# EasyEDA schematic lighting_schematic.json
TITLE: PeaPod Lighting; REV: 0.1; Date: 2021-03-17; Sheet: 1/1; Drawn By: Jayden Lefebvre; Company: UofT Agritech
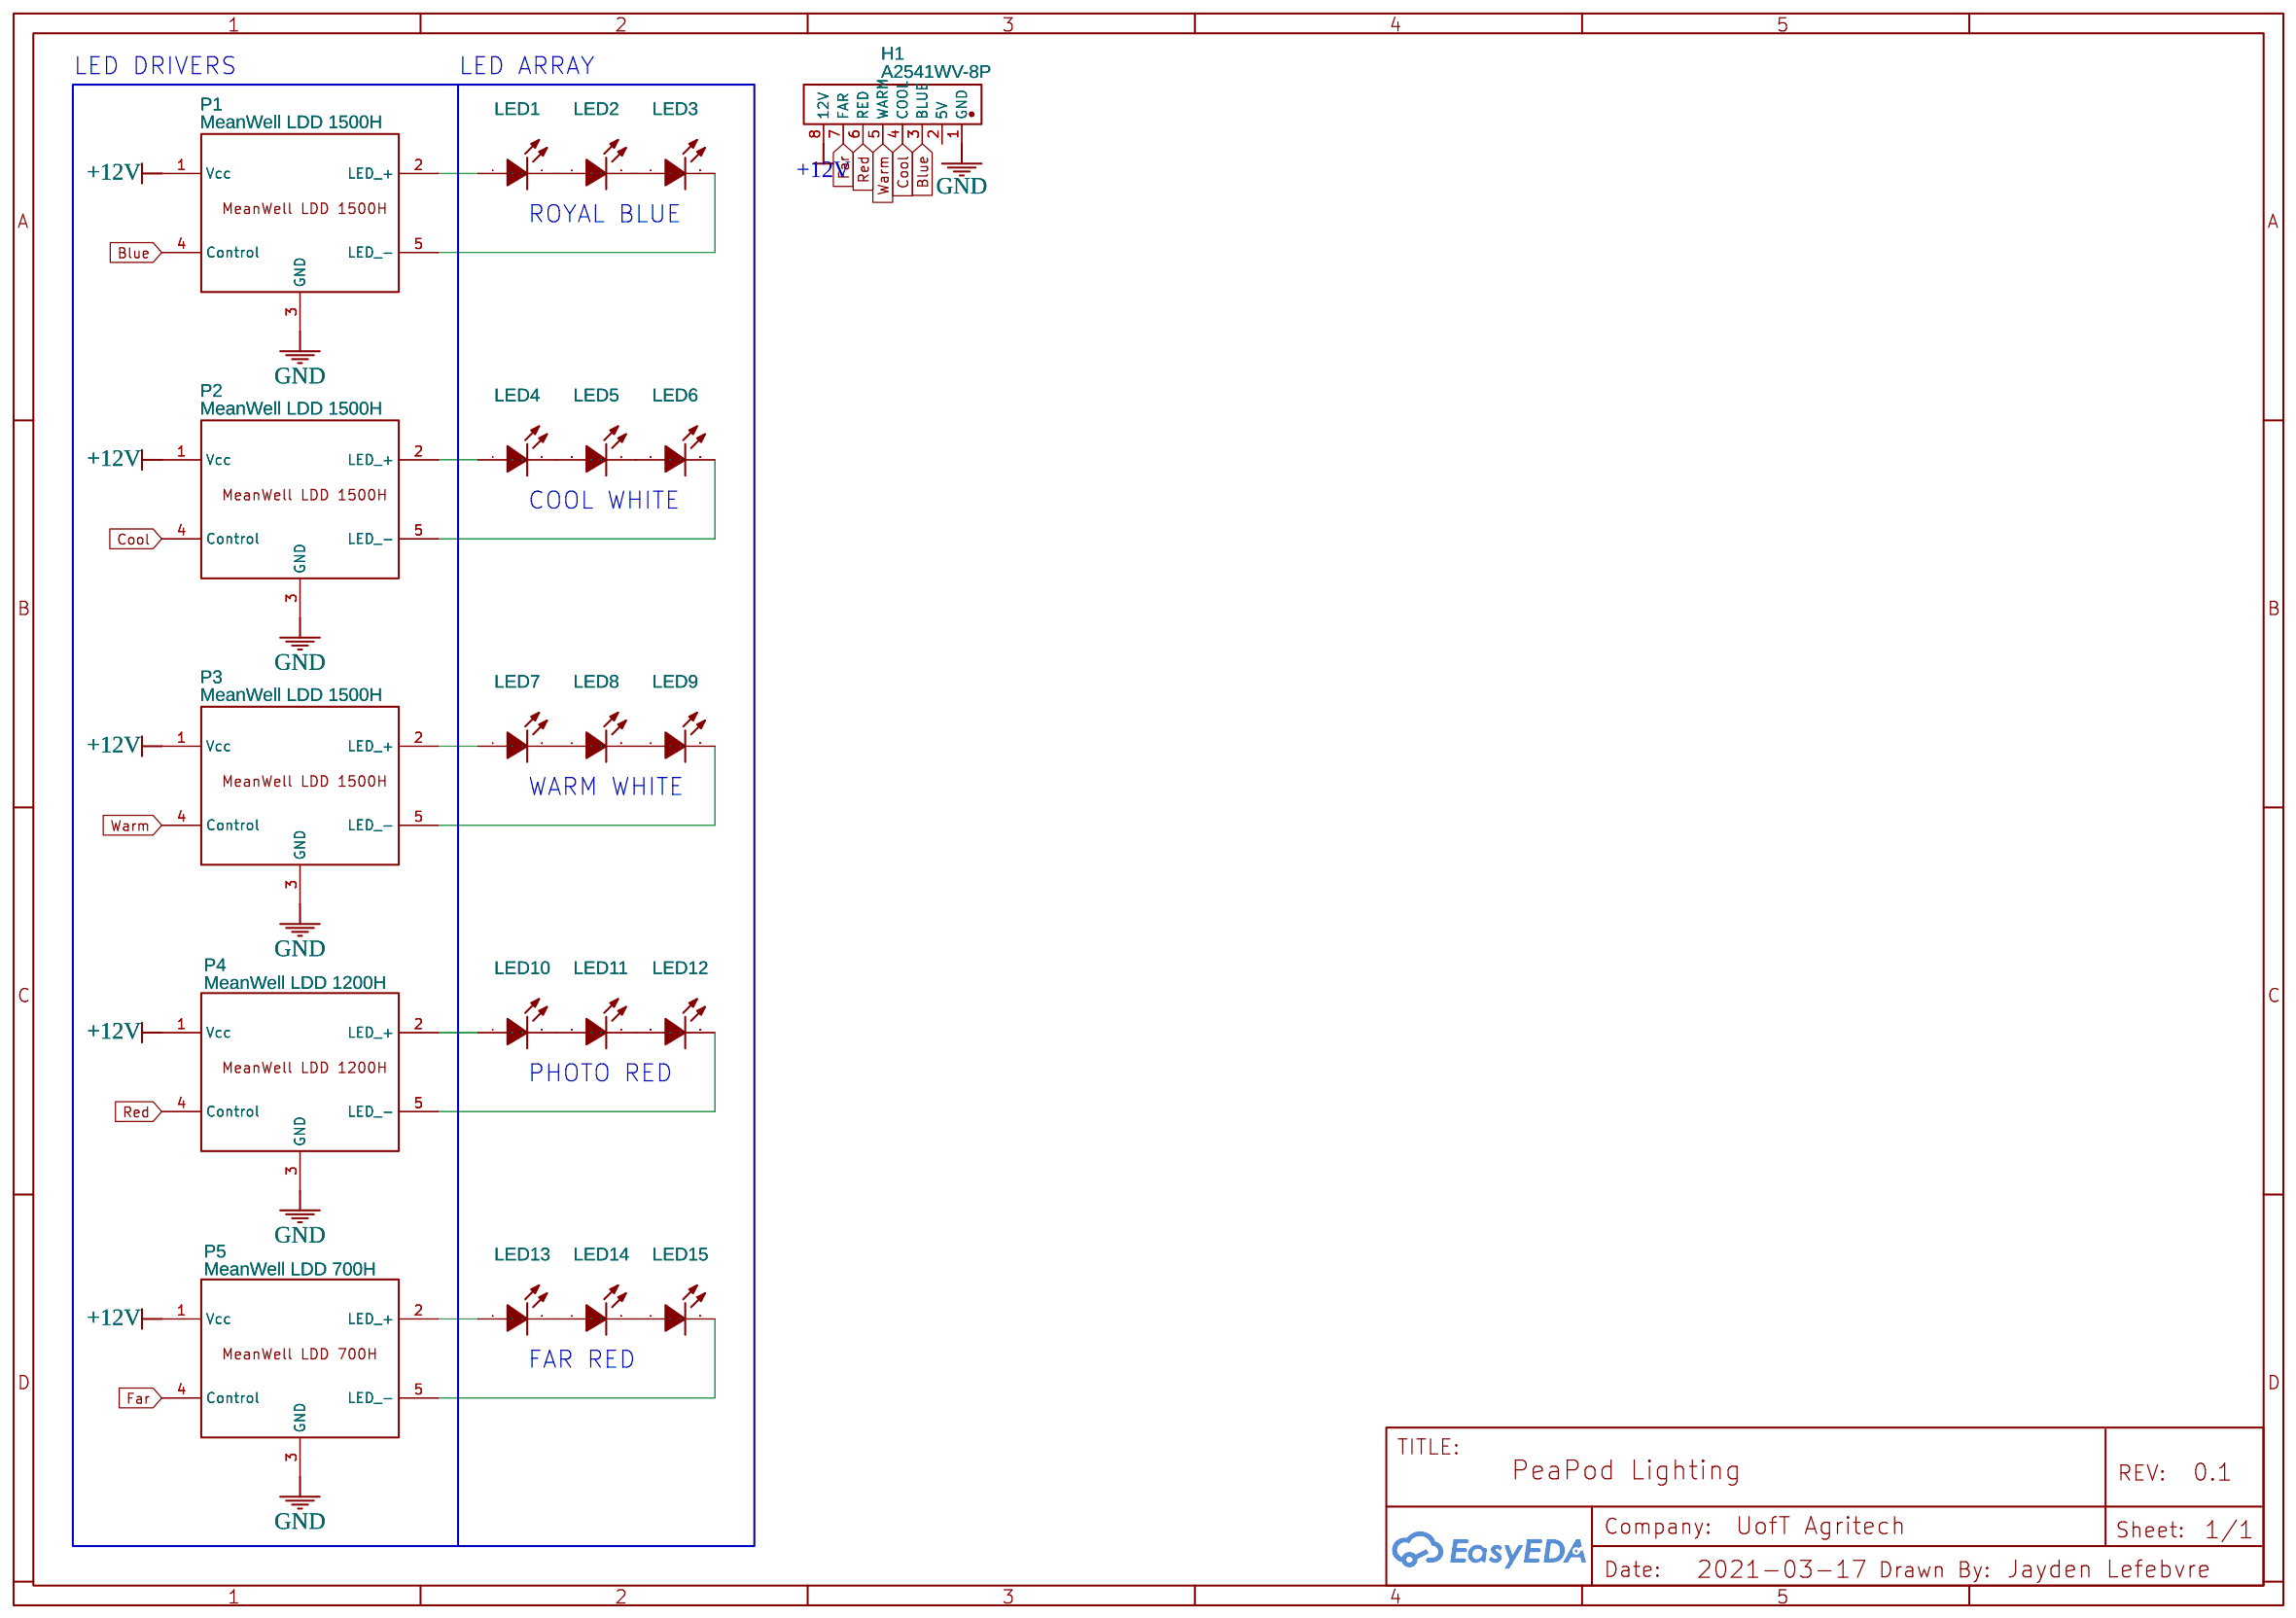
[diagram p0: schematic sheet]

## Parts
H1  A2541WV-8P  [HDR-TH_8P-P2.54-V-M]
LED1  XLAMP XP-G3 LED  [XLAMP XP-G3 LED]
LED2  XLAMP XP-G3 LED  [XLAMP XP-G3 LED]
LED3  XLAMP XP-G3 LED  [XLAMP XP-G3 LED]
LED4  XLAMP XP-G3 LED  [XLAMP XP-G3 LED]
LED5  XLAMP XP-G3 LED  [XLAMP XP-G3 LED]
LED6  XLAMP XP-G3 LED  [XLAMP XP-G3 LED]
LED7  XLAMP XP-G3 LED  [XLAMP XP-G3 LED]
LED8  XLAMP XP-G3 LED  [XLAMP XP-G3 LED]
LED9  XLAMP XP-G3 LED  [XLAMP XP-G3 LED]
LED10  XLAMP XP-G3 LED  [XLAMP XP-G3 LED]
LED11  XLAMP XP-G3 LED  [XLAMP XP-G3 LED]
LED12  XLAMP XP-G3 LED  [XLAMP XP-G3 LED]
LED13  XLAMP XP-G3 LED  [XLAMP XP-G3 LED]
LED14  XLAMP XP-G3 LED  [XLAMP XP-G3 LED]
LED15  XLAMP XP-G3 LED  [XLAMP XP-G3 LED]
P1  MeanWell LDD 1500H  [MEANWELL LDD 1500H]
P2  MeanWell LDD 1500H  [MEANWELL LDD 1500H]
P3  MeanWell LDD 1500H  [MEANWELL LDD 1500H]
P4  MeanWell LDD 1200H  [MEANWELL LDD 1200H]
P5  MeanWell LDD 700H  [MEANWELL LDD 700H]

## Library data of the parts
H1 = A2541WV-8P: Supplier: LCSC; Supplier Part: C225483; Manufacturer: Changjiang Connectors; Contributor: LCSC; Paste Type: expand; Assembly Type: manualWeld
LED1-LED15 = XLAMP XP-G3 LED: Supplier: Digi-Key; Manufacturer: CREE; Manufacturer Part: XPGDWT-01-0000-00ME3; Supplier Part: XPGDWT-01-0000-00ME3; link: https://www.cree.com/led-components/media/documents/dsXPG3.pdf
P1-P3 = MeanWell LDD 1500H: Manufacturer: MeanWell; Manufacturer Part: LDD-1500H; Supplier Part: 1866-3099-ND; Supplier: Digi-Key; link: https://www.meanwell.com/Upload/PDF/LDD-H/LDD-H-SPEC.PDF; Contributor: JLefebvre55
P4 = MeanWell LDD 1200H: Manufacturer: MeanWell; Manufacturer Part: LDD-1200H; Supplier Part: 1866-3095-ND; Supplier: Digi-Key; link: https://www.meanwell.com/Upload/PDF/LDD-H/LDD-H-SPEC.PDF; Contributor: JLefebvre55
P5 = MeanWell LDD 700H: Manufacturer: MeanWell; Manufacturer Part: LDD-700H; Supplier Part: 1866-3119-ND; Supplier: Digi-Key; link: https://www.meanwell.com/Upload/PDF/LDD-H/LDD-H-SPEC.PDF; Contributor: JLefebvre55

## Nets
+12V: H1.8(12V) P1.1(Vcc) P2.1(Vcc) P3.1(Vcc) P4.1(Vcc) P5.1(Vcc)
GND: H1.1(GND) P1.3(GND) P2.3(GND) P3.3(GND) P4.3(GND) P5.3(GND)
Blue: H1.3(BLUE) P1.4(Control)
Cool: H1.4(COOL) P2.4(Control)
Far: H1.7(FAR) P5.4(Control)
Red: H1.6(RED) P4.4(Control)
Warm: H1.5(WARM) P3.4(Control)
Net-(LED1-1): LED1.1(A) P1.2(LED +)
Net-(LED1-2): LED1.2(K) LED2.1(A)
Net-(LED2-2): LED2.2(K) LED3.1(A)
Net-(LED3-2): LED3.2(K) P1.5(LED -)
Net-(LED4-1): LED4.1(A) P2.2(LED +)
Net-(LED4-2): LED4.2(K) LED5.1(A)
Net-(LED5-2): LED5.2(K) LED6.1(A)
Net-(LED6-2): LED6.2(K) P2.5(LED -)
Net-(LED7-1): LED7.1(A) P3.2(LED +)
Net-(LED7-2): LED7.2(K) LED8.1(A)
Net-(LED8-2): LED8.2(K) LED9.1(A)
Net-(LED9-2): LED9.2(K) P3.5(LED -)
Net-(LED10-1): LED10.1(A) P4.2(LED +)
Net-(LED10-2): LED10.2(K) LED11.1(A)
Net-(LED11-2): LED11.2(K) LED12.1(A)
Net-(LED12-2): LED12.2(K) P4.5(LED -)
Net-(LED13-1): LED13.1(A) P5.2(LED +)
Net-(LED13-2): LED13.2(K) LED14.1(A)
Net-(LED14-2): LED14.2(K) LED15.1(A)
Net-(LED15-2): LED15.2(K) P5.5(LED -)

Not connected (* = marked no-connect by the designer): H1 2(5V)

## Notes on the sheet
- LED DRIVERS
- LED ARRAY
- ROYAL BLUE
- COOL WHITE
- WARM WHITE
- PHOTO RED
- FAR RED
